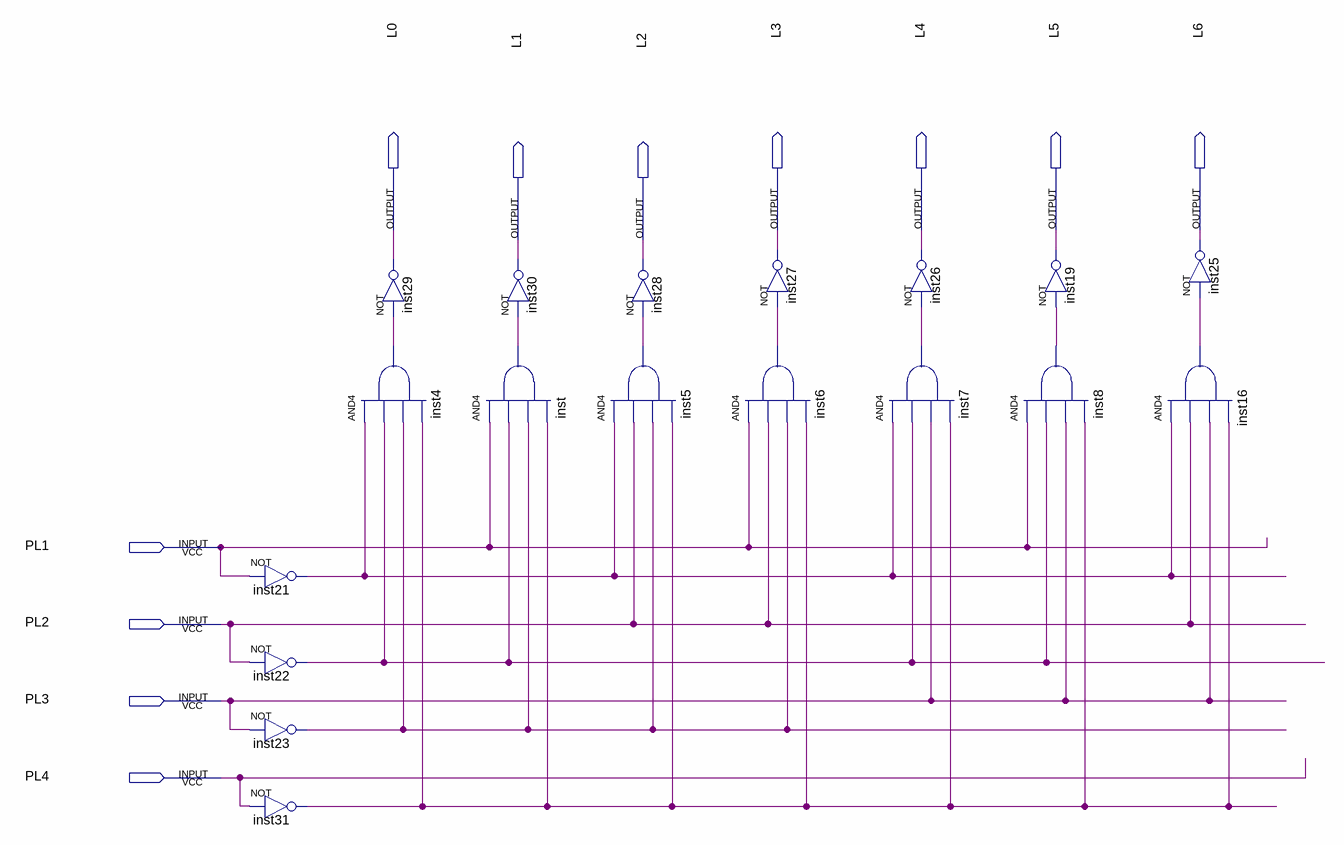
[diagram p0: schematic sheet]
// Quartus schematic PBL1-2.bdf as structural Verilog: 18 symbols, 11 pins
module \PBL1-2  (
  input  PL1,
  input  PL2,
  input  PL3,
  input  PL4,
  output L0,
  output L3,
  output L4,
  output L5,
  output L6,
  output L1,
  output L2
);

  wire inst4_out, inst5_out, inst6_out, inst7_out, inst8_out, inst16_out, inst21_out, inst22_out, inst23_out,
       inst31_out, inst_out;

  not inst21 (inst21_out, PL1);
  not inst22 (inst22_out, PL2);
  not inst23 (inst23_out, PL3);
  not inst31 (inst31_out, PL4);
  not inst29 (L0, inst4_out);
  and inst4 (inst4_out, inst21_out, inst22_out, inst23_out, inst31_out);
  and inst (inst_out, PL1, inst22_out, inst23_out, inst31_out);
  not inst30 (L1, inst_out);
  not inst28 (L2, inst5_out);
  and inst5 (inst5_out, inst21_out, PL2, inst23_out, inst31_out);
  not inst27 (L3, inst6_out);
  and inst6 (inst6_out, PL1, PL2, inst23_out, inst31_out);
  not inst26 (L4, inst7_out);
  and inst7 (inst7_out, inst21_out, inst22_out, PL3, inst31_out);
  and inst8 (inst8_out, PL1, inst22_out, PL3, inst31_out);
  not inst19 (L5, inst8_out);
  and inst16 (inst16_out, inst21_out, PL2, PL3, inst31_out);
  not inst25 (L6, inst16_out);
endmodule
